# EAGLE schematic adhit RR (EAGLE 9.6.2)
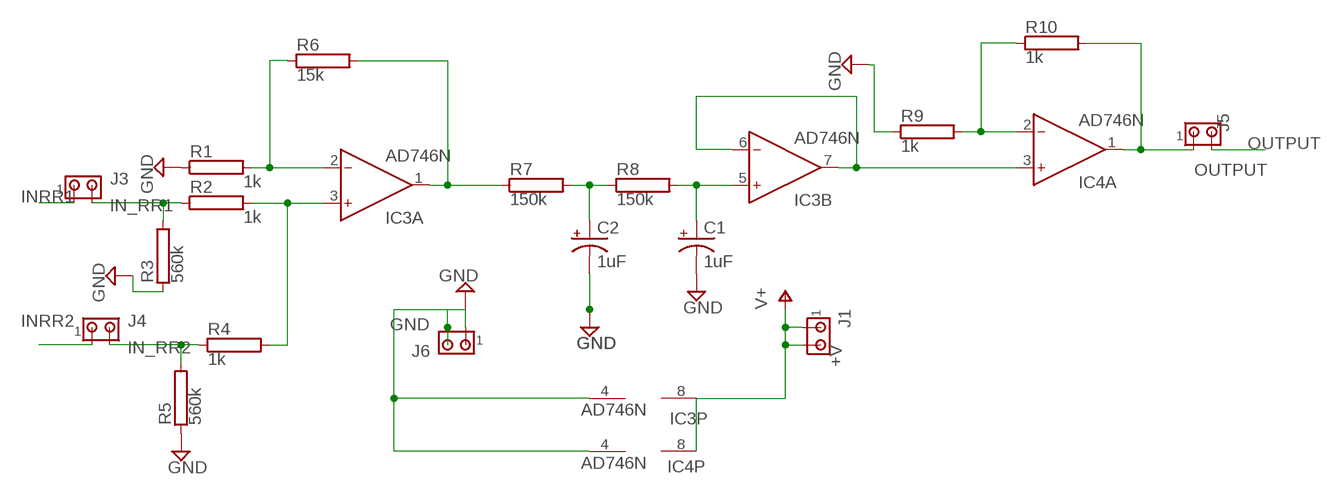
[diagram p0: schematic, sheet 1]

## Parts
C1  1uF  CPOL-USE2,5-6E  [E2,5-6E]
C2  1uF  CPOL-USE2,5-6E  [E2,5-6E]
IC3  AD746N  [DIL08]
IC4  AD746N  [DIL08]
J1  +V  MTA02-156  [1X2MTA]
J3  IN_RR1  MTA02-156  [1X2MTA]
J4  IN_RR2  MTA02-156  [1X2MTA]
J5  OUTPUT  MTA02-156  [1X2MTA]
J6  GND  MTA02-156  [1X2MTA]
R1  1k  RAC01  [AC01]
R2  1k  RAC01  [AC01]
R3  560k  RAC01  [AC01]
R4  1k  RAC01  [AC01]
R5  560k  RAC01  [AC01]
R6  15k  RAC01  [AC01]
R7  150k  RAC01  [AC01]
R8  150k  RAC01  [AC01]
R9  1k  RAC01  [AC01]
R10  1k  RAC01  [AC01]

## Nets
GND: C1.- C2.- IC3.4(P:V-) IC4.4(P:V-) J6.1 J6.2 R1.1 R3.1 R5.1 R9.1
INRR1: J3.1
INRR2: J4.1
N$1: IC3.2(A:IN-) R1.2 R6.1
N$2: IC3.3(A:IN+) R2.2 R4.2
N$3: J3.2 R2.1 R3.2
N$4: IC3.1(A:OUT) R6.2 R7.1
N$5: IC4.2(A:IN-) R9.2 R10.1
N$6: C2.+ R7.2 R8.1
N$7: C1.+ IC3.5(B:IN+) R8.2
N$10: J4.2 R4.1 R5.2
N$11: IC3.6(B:IN-) IC3.7(B:OUT) IC4.3(A:IN+)
N$12: IC4.1(A:OUT) J5.1 R10.2
OUTPUT: J5.2
V+: IC3.8(P:V+) IC4.8(P:V+) J1.1 J1.2
Unconnected: IC4.5(B:IN+) IC4.6(B:IN-) IC4.7(B:OUT)

## Library data of the parts
C1 C2 = rcl:CPOL-US: POLARIZED CAPACITOR, American symbol; SPICEPREFIX: C
IC3 IC4 = analog-devices:AD746: Dual Precision, 500 ns Settling, BiFET Op Amp Source: http://www.analog.com/static/imported-files/data_sheets/AD746.pdf; MF: ALTERA CORPORATION; MPN: AD746JNZ; OC_FARNELL: 1438363; OC_NEWARK: 59K4844
J1 J3-J6 = con-amp:MTA02-156: AMP connector
R1-R10 = resistor-power:R: Power Resitor; OC_FARNELL: unknown; OC_NEWARK: unknown